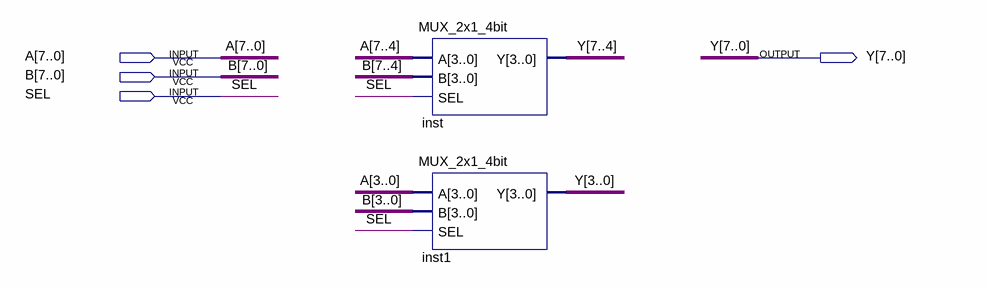
[diagram p0: schematic sheet]
// Quartus schematic MUX_2x1_8bit.bdf as structural Verilog: 2 symbols, 4 pins
module MUX_2x1_8bit (
  input  [7:0] A,
  input  [7:0] B,
  input  SEL,
  output [7:0] Y
);

  MUX_2x1_4bit inst (.A(A[7:4]), .B(B[7:4]), .SEL(SEL), .Y(Y[7:4]));
  MUX_2x1_4bit inst1 (.A(A[3:0]), .B(B[3:0]), .SEL(SEL), .Y(Y[3:0]));
endmodule
